# Altium project FireWireSw_v2.PrjPcb
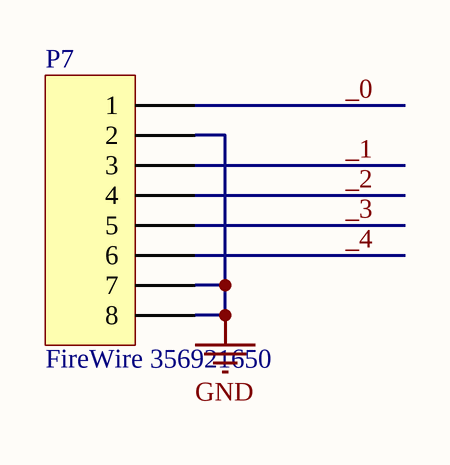
[diagram p0: sch.SchDoc]
1 sheet, 1 parts. Net scope: global (net labels, ports and power ports of the same name join across sheets).
Board file: brd.PcbDoc

## Sheet sch.SchDoc
size A4

### Parts
P7  FireWire 356921650  [DS1102]

### Nets
GND: P7.2 P7.7 P7.8
_0: P7.1
_1: P7.3
_2: P7.4
_3: P7.5
_4: P7.6

### Library data of the parts
P7 = Header 8: IEEE 1394 (DS1102), SMD розетка на плату (OBSOLETE); LatestRevisionDate: 17-Jul-2002; LatestRevisionNote: Re-released for DXP Platform.; Publisher: Altium Limited